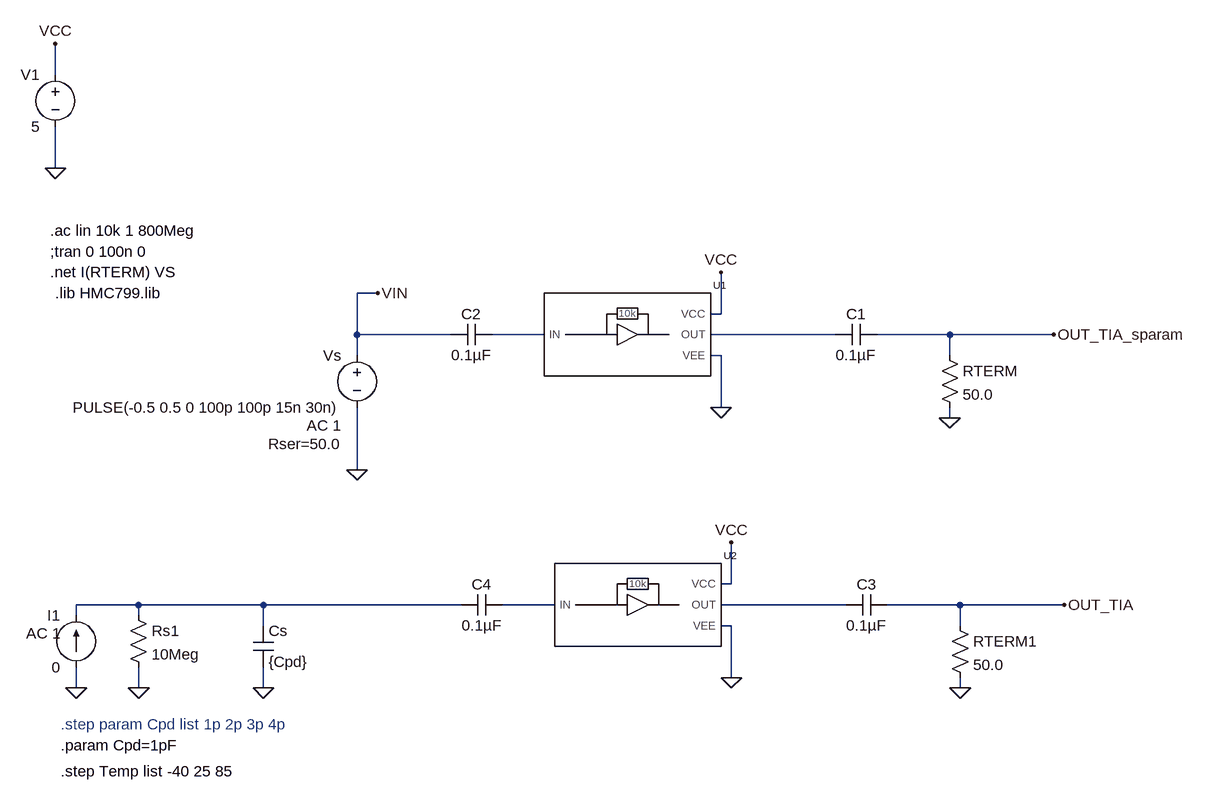
[diagram p0: schematic HMC799_Test_Bench.asc]
HMC799_Test_Bench.asc, the LTspice schematic file:
Version 4
SHEET 1 5332 2548
WIRE 1680 -928 1680 -976
WIRE 1680 -784 1680 -848
WIRE 2176 -592 2144 -592
WIRE 2704 -560 2704 -624
WIRE 2704 -560 2688 -560
WIRE 2144 -528 2144 -592
WIRE 2288 -528 2144 -528
WIRE 2432 -528 2352 -528
WIRE 2880 -528 2688 -528
WIRE 3056 -528 2944 -528
WIRE 3216 -528 3056 -528
WIRE 2144 -496 2144 -528
WIRE 2704 -496 2688 -496
WIRE 3056 -496 3056 -528
WIRE 2704 -416 2704 -496
WIRE 3056 -400 3056 -416
WIRE 2144 -320 2144 -416
WIRE 2720 -144 2720 -208
WIRE 2720 -144 2704 -144
WIRE 1808 -112 1712 -112
WIRE 2000 -112 1808 -112
WIRE 2304 -112 2000 -112
WIRE 2448 -112 2368 -112
WIRE 2896 -112 2704 -112
WIRE 3072 -112 2960 -112
WIRE 3232 -112 3072 -112
WIRE 1712 -96 1712 -112
WIRE 1808 -96 1808 -112
WIRE 2000 -80 2000 -112
WIRE 2720 -80 2704 -80
WIRE 3072 -80 3072 -112
WIRE 2720 0 2720 -80
WIRE 1712 16 1712 -16
WIRE 1808 16 1808 -16
WIRE 2000 16 2000 -16
WIRE 3072 16 3072 0
FLAG 1680 -976 VCC
FLAG 1680 -784 0
FLAG 2144 -320 0
FLAG 2176 -592 VIN
FLAG 3216 -528 OUT_TIA_sparam
FLAG 3056 -400 0
FLAG 2704 -416 0
FLAG 2704 -624 VCC
FLAG 3232 -112 OUT_TIA
FLAG 3072 16 0
FLAG 2720 0 0
FLAG 2720 -208 VCC
FLAG 1712 16 0
FLAG 1808 16 0
FLAG 2000 16 0
SYMBOL voltage 1680 -944 M0
WINDOW 123 0 0 Left 0
WINDOW 39 0 0 Left 0
SYMATTR InstName V1
SYMATTR Value 5
SYMBOL voltage 2144 -512 M0
WINDOW 123 24 124 Left 2
WINDOW 39 24 152 Left 2
SYMATTR Value2 AC 1
SYMATTR SpiceLine Rser=50.0
SYMATTR InstName Vs
SYMATTR Value PULSE(-0.5 0.5 0 100p 100p 15n 30n)
SYMBOL res 3040 -512 R0
SYMATTR InstName RTERM
SYMATTR Value 50.0
SYMBOL cap 2944 -544 R90
WINDOW 0 0 32 VBottom 2
WINDOW 3 32 32 VTop 2
SYMATTR InstName C1
SYMATTR Value 0.1µF
SYMBOL cap 2352 -544 R90
WINDOW 0 0 32 VBottom 2
WINDOW 3 32 32 VTop 2
SYMATTR InstName C2
SYMATTR Value 0.1µF
SYMBOL HMC799 2560 -528 R0
SYMATTR InstName U1
SYMBOL res 3056 -96 R0
SYMATTR InstName RTERM1
SYMATTR Value 50.0
SYMBOL cap 2960 -128 R90
WINDOW 0 0 32 VBottom 2
WINDOW 3 32 32 VTop 2
SYMATTR InstName C3
SYMATTR Value 0.1µF
SYMBOL cap 2368 -128 R90
WINDOW 0 0 32 VBottom 2
WINDOW 3 32 32 VTop 2
SYMATTR InstName C4
SYMATTR Value 0.1µF
SYMBOL HMC799 2576 -112 R0
SYMATTR InstName U2
SYMBOL current 1712 -16 R180
WINDOW 0 24 80 Left 2
WINDOW 3 24 0 Left 2
WINDOW 123 24 52 Left 2
WINDOW 39 0 0 Left 0
SYMATTR InstName I1
SYMATTR Value 0
SYMATTR Value2 AC 1
SYMBOL res 1792 -112 R0
SYMATTR InstName Rs1
SYMATTR Value 10Meg
SYMBOL cap 1984 -80 R0
SYMATTR InstName Cs
SYMATTR Value {Cpd}
TEXT 1672 -656 Left 2 !;tran 0 100n 0
TEXT 1672 -688 Left 2 !.ac lin 10k 1 800Meg
TEXT 1672 -624 Left 2 !.net I(RTERM) VS
TEXT 1680 -592 Left 2 !.lib HMC799.lib
TEXT 1688 144 Left 2 !.step Temp list -40 25 85
TEXT 1688 72 Left 2 ;.step param Cpd list 1p 2p 3p 4p
TEXT 1688 104 Left 2 !.param Cpd=1pF

The netlist it stands for:
* HMC799_Test_Bench.asc
V1 VCC 0 5
Vs VIN 0 PULSE(-0.5 0.5 0 100p 100p 15n 30n) AC 1 Rser=50.0
RTERM OUT_TIA_sparam 0 50.0
C1 OUT_TIA_sparam N002 0.1µF
C2 N001 VIN 0.1µF
XU1 N001 N002 VCC 0 HMC799  ; pins IN OUT VCC VEE
RTERM1 OUT_TIA 0 50.0
C3 OUT_TIA N005 0.1µF
C4 N004 N003 0.1µF
XU2 N004 N005 VCC 0 HMC799  ; pins IN OUT VCC VEE
I1 0 N003 0 AC 1
Rs1 N003 0 10Meg
Cs N003 0 {Cpd}
;tran 0 100n 0
.ac lin 10k 1 800Meg
.net I(RTERM) VS
.lib HMC799.lib
.step Temp list -40 25 85
* .step param Cpd list 1p 2p 3p 4p
.param Cpd=1pF
.backanno
.end